# Altium schematic sheet SP26_Magnetometer2_Polarization_Circuit_Mason_Lebens.SchDoc
size A; SheetNumber: 3; SheetTotal: 6
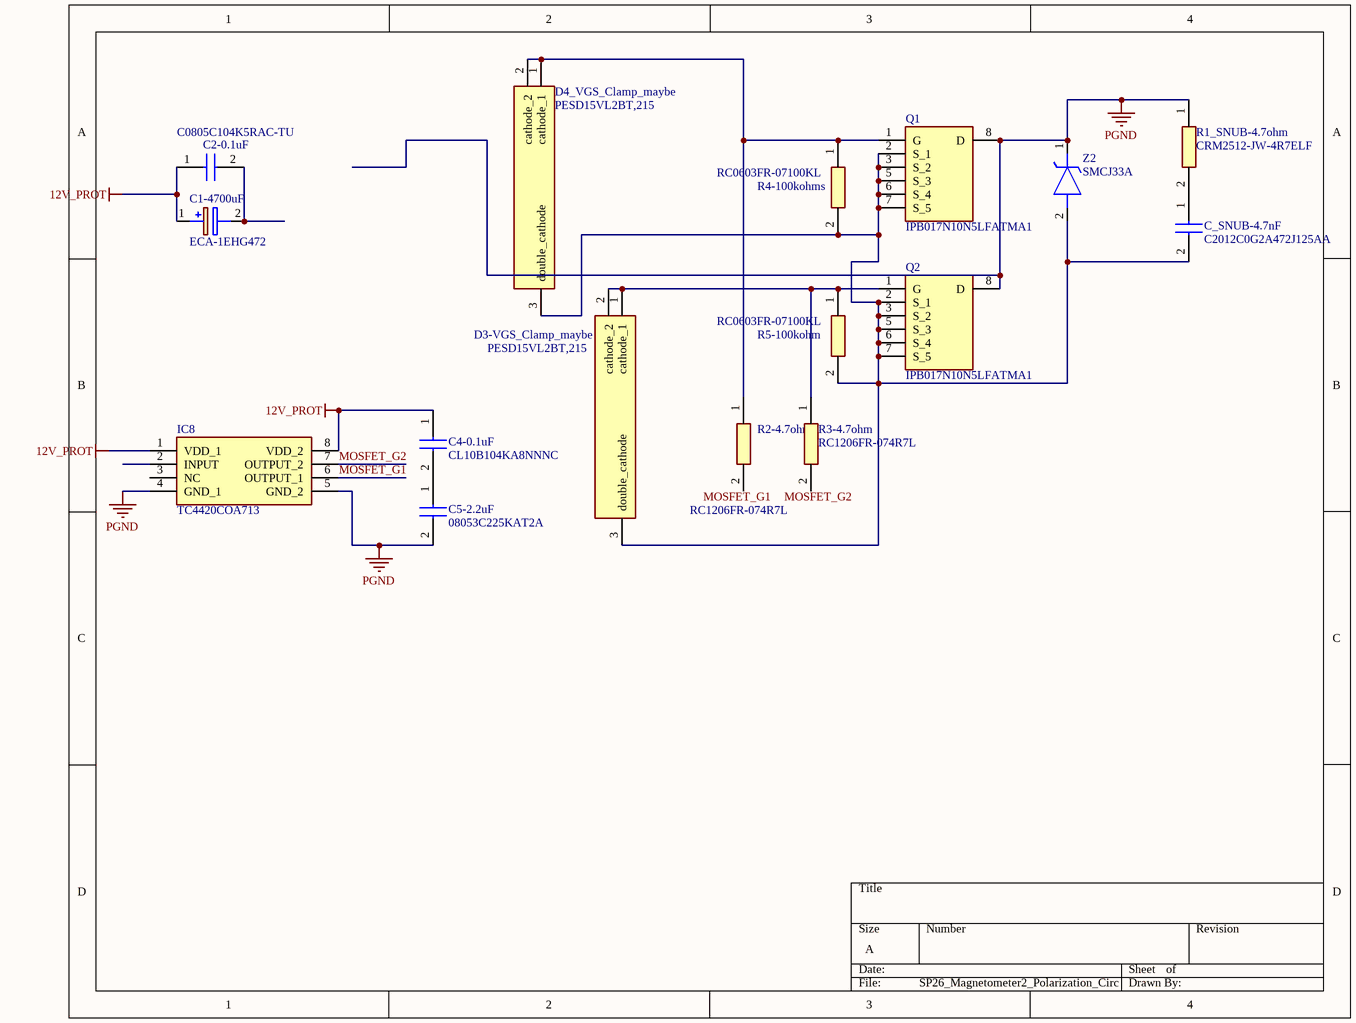
[diagram p0: SP26_Magnetometer2_Polarization_Circuit_Mason_Lebens.SchDoc]

## Parts
C1-4700uF  ECA-1EHG472  [CAPPRD750W80D800H3150]
C2-0.1uF  C0805C104K5RAC-TU  [CAPC2012X88N]
C4-0.1uF  CL10B104KA8NNNC  [CAPC1608X90N]
C5-2.2uF  08053C225KAT2A  [CAPC2012X152N]
C_SNUB-4.7nF  C2012C0G2A472J125AA  [CAPC2012X145N]
D3-VGS_Clamp_maybe  PESD15VL2BT,215  [SOT95P230X110-3N]
D4_VGS_Clamp_maybe  PESD15VL2BT,215  [SOT95P230X110-3N]
IC8  TC4420COA713  [SOIC127P600X175-8N]
Q1  IPB017N10N5LFATMA1  [PG-TO263-7-3_3]
Q2  IPB017N10N5LFATMA1  [PG-TO263-7-3_3]
R1_SNUB-4.7ohm  CRM2512-JW-4R7ELF  [RESC6331X80N]
R2-4.7ohm  RC1206FR-074R7L  [RESC3116X65N]
R3-4.7ohm  RC1206FR-074R7L  [RESC3116X65N]
R4-100kohms  RC0603FR-07100KL  [RESC1608X55N]
R5-100kohm  RC0603FR-07100KL  [RESC1608X55N]
Z2  SMCJ33A  [DIOM7969X262N]

## Nets
12V_PROT: C1-4700uF.1(+) C2-0.1uF.1 C4-0.1uF.1 IC8.1(VDD_1) IC8.8(VDD_2)
PGND: C5-2.2uF.2 IC8.4(GND_1) IC8.5(GND_2) Q1.8(D) Q2.8(D) R1_SNUB-4.7ohm.1 Z2.1(K)
MOSFET_G1: IC8.6(OUTPUT_1)
MOSFET_G2: IC8.7(OUTPUT_2)
NetC1-4700uF_2: C1-4700uF.2(-) C2-0.1uF.2
NetC4-0.1uF_2: C4-0.1uF.2 C5-2.2uF.1
NetC_SNUB-4.7nF_1: C_SNUB-4.7nF.1 R1_SNUB-4.7ohm.2
NetC_SNUB-4.7nF_2: C_SNUB-4.7nF.2 D3-VGS_Clamp_maybe.3(double_cathode) D4_VGS_Clamp_maybe.3(double_cathode) Q1.2(S_1) Q1.3(S_2) Q1.5(S_3) Q1.6(S_4) Q1.7(S_5) Q2.2(S_1) Q2.3(S_2) Q2.5(S_3) Q2.6(S_4) Q2.7(S_5) R4-100kohms.2 R5-100kohm.2 Z2.2(A)
NetD3-VGS_Clamp_maybe_1: D3-VGS_Clamp_maybe.1(cathode_1) D3-VGS_Clamp_maybe.2(cathode_2) Q2.1(G) R3-4.7ohm.1 R5-100kohm.1
NetD4_VGS_Clamp_maybe_1: D4_VGS_Clamp_maybe.1(cathode_1) D4_VGS_Clamp_maybe.2(cathode_2) Q1.1(G) R2-4.7ohm.1 R4-100kohms.1

Not connected (* = marked no-connect by the designer): IC8 2(INPUT) 3(NC); R2-4.7ohm 2; R3-4.7ohm 2

## Notes on the sheet
- Labels drawn without touching a wire or pin: MOSFET_G1, MOSFET_G2

## Library data of the parts
C1-4700uF = ECA-1EHG472: Capacitor Polarised; Manufacturer_Name: Panasonic; Datasheet Link: http://industrial.panasonic.com/cdbs/www-data/pdf/RDF0000/ABA0000C1215.pdf; Height: 31.5mm; Manufacturer_Part_Number: ECA-1EHG472; Mouser Part Number: 667-ECA-1EHG472; Mouser Price/Stock: https://www.mouser.co.uk/ProductDetail/Panasonic/ECA-1EHG472?qs=SSsrj1O973IsymGcmYwUsw%3D%3D; Arrow Part Number: ECA-1EHG472; Arrow Price/Stock: https://www.arrow.com/en/products/eca-1ehg472/panasonic?region=nac
C2-0.1uF = C0805C104K5RAC-TU: Capacitor; Manufacturer_Name: YAGEO; Datasheet Link: https://componentsearchengine.com/Datasheets/2/C0805C104K5RAC-TU.pdf; Height: 0.88mm; Manufacturer_Part_Number: C0805C104K5RAC-TU; Arrow Part Number: C0805C104K5RAC-TU; Arrow Price/Stock: https://www.arrow.com/en/products/c0805c104k5ractu/kemet-corporation
C4-0.1uF = CL10B104KA8NNNC: Capacitor; Manufacturer_Name: SAMSUNG; Datasheet Link: http://media.digikey.com/pdf/Data%20Sheets/Samsung%20PDFs/CL_Series_MLCC_ds.pdf; Height: 0.9mm; Manufacturer_Part_Number: CL10B104KA8NNNC; Mouser Part Number: 187-CL10B104KA8NNNC; Mouser Price/Stock: https://www.mouser.co.uk/ProductDetail/Samsung-Electro-Mechanics/CL10B104KA8NNNC?qs=349EhDEZ59rmu3pGeZXx0A%3D%3D; Arrow Part Number: CL10B104KA8NNNC; Arrow Price/Stock: https://www.arrow.com/en/products/cl10b104ka8nnnc/samsung-electro-mechanics?utm_currency=USD&region=europe
C5-2.2uF = 08053C225KAT2A: Capacitor; Manufacturer_Name: Kyocera AVX; Datasheet Link: https://datasheet.datasheetarchive.com/originals/distributors/Datasheets-DGA10/2418872.pdf; Height: 1.52mm; Manufacturer_Part_Number: 08053C225KAT2A; Mouser Part Number: 581-08053C225K; Mouser Price/Stock: https://www.mouser.co.uk/ProductDetail/KYOCERA-AVX/08053C225KAT2A?qs=NlNVDDZd7xSL5kNgCOchrA%3D%3D; Arrow Part Number: 08053C225KAT2A; Arrow Price/Stock: https://www.arrow.com/en/products/08053c225kat2a/avx
C_SNUB-4.7nF = C2012C0G2A472J125AA: Capacitor; Manufacturer_Name: TDK; Datasheet Link: https://product.tdk.com/info/en/catalog/datasheets/mlcc_commercial_midvoltage_en.pdf; Height: 1.45mm; Manufacturer_Part_Number: C2012C0G2A472J125AA; Mouser Part Number: 810-C2012C0G2A472J; Mouser Price/Stock: https://www.mouser.co.uk/ProductDetail/TDK/C2012C0G2A472J125AA?qs=NRhsANhppD%252Bumxfv0IUAjg%3D%3D; Arrow Part Number: C2012C0G2A472J125AA; Arrow Price/Stock: https://www.arrow.com/en/products/c2012c0g2a472j125aa/tdk?utm_currency=USD&region=nac
D3-VGS_Clamp_maybe D4_VGS_Clamp_maybe = PESD15VL2BT,215: Diode; Manufacturer_Name: Nexperia; Datasheet Link: https://assets.nexperia.com/documents/data-sheet/PESDXL2BT_SER.pdf; Height: 1.1mm; Manufacturer_Part_Number: PESD15VL2BT,215; Mouser Part Number: 771-PESD15VL2BT-T/R; Mouser Price/Stock: https://www.mouser.co.uk/ProductDetail/Nexperia/PESD15VL2BT215?qs=LOCUfHb8d9vyDy2ag0hbbA%3D%3D; Arrow Part Number: PESD15VL2BT,215; Arrow Price/Stock: https://www.arrow.com/en/products/pesd15vl2bt215/nexperia?region=nac
IC8 = TC4420COA713: Integrated Circuit; Manufacturer_Name: Microchip; Datasheet Link: https://www.mouser.de/datasheet/2/268/21419D-3441717.pdf; Height: 1.75mm; Manufacturer_Part_Number: TC4420COA713; Mouser Part Number: 579-TC4420COA713; Mouser Price/Stock: https://www.mouser.co.uk/ProductDetail/Microchip-Technology/TC4420COA713?qs=KwArPi4cUohqVwIUJ%2FLcSA%3D%3D; Arrow Part Number: TC4420COA713; Arrow Price/Stock: https://www.arrow.com/en/products/tc4420coa713/microchip-technology?utm_currency=USD&region=nac
Q1 Q2 = IPB017N10N5LFATMA1: MOSFET (N-Channel); Manufacturer_Name: Infineon; Datasheet Link: https://www.infineon.com/dgdl/Infineon-IPB017N10N5LF-DS-v02_01-EN.pdf?fileId=5546d46259d9a4bf015a5b379cf73c7f; Manufacturer_Part_Number: IPB017N10N5LFATMA1; Mouser Part Number: 726-IPB017N10N5LFATM; Mouser Price/Stock: https://www.mouser.co.uk/ProductDetail/Infineon-Technologies/IPB017N10N5LFATMA1?qs=u4fy%2FsgLU9OXGa2ke5Uurw%3D%3D; Arrow Part Number: IPB017N10N5LFATMA1; Arrow Price/Stock: https://www.arrow.com/en/products/ipb017n10n5lfatma1/infineon-technologies-ag?utm_currency=USD&region=europe
R1_SNUB-4.7ohm = CRM2512-JW-4R7ELF: Resistor; Manufacturer_Name: Bourns; Datasheet Link: http://www.bourns.com/data/global/pdfs/CRM0805_1206_2010.pdf; Height: 0.8mm; Manufacturer_Part_Number: CRM2512-JW-4R7ELF; Mouser Part Number: 652-CRM2512JW4R7ELF; Mouser Price/Stock: https://www.mouser.co.uk/ProductDetail/Bourns/CRM2512-JW-4R7ELF?qs=%2FxQVPCMPNzhuvoImpXatPQ%3D%3D; Arrow Part Number: CRM2512-JW-4R7ELF; Arrow Price/Stock: https://www.arrow.com/en/products/crm2512-jw-4r7elf/bourns
R2-4.7ohm R3-4.7ohm = RC1206FR-074R7L: Resistor; Manufacturer_Name: YAGEO; Datasheet Link: https://www.sos.sk/productdata/35/10/4/35104/RC1206.pdf; Height: 0.65mm; Manufacturer_Part_Number: RC1206FR-074R7L; Mouser Part Number: 603-RC1206FR-074R7L; Mouser Price/Stock: https://www.mouser.com/Search/Refine.aspx?Keyword=603-RC1206FR-074R7L; Arrow Part Number: RC1206FR-074R7L; Arrow Price/Stock: https://www.arrow.com/en/products/rc1206fr-074r7l/yageo
R4-100kohms R5-100kohm = RC0603FR-07100KL: Resistor; Manufacturer_Name: YAGEO; Datasheet Link: https://www.yageo.com/upload/media/product/productsearch/datasheet/rchip/PYu-RC_Group_51_RoHS_L_12.pdf; Height: 0.55mm; Manufacturer_Part_Number: RC0603FR-07100KL; Mouser Part Number: 603-RC0603FR-07100KL; Mouser Price/Stock: https://www.mouser.co.uk/ProductDetail/YAGEO/RC0603FR-07100KL?qs=e1ok2LiJcmaihem8Va5%2Fsw%3D%3D; Arrow Part Number: RC0603FR-07100KL; Arrow Price/Stock: https://www.arrow.com/en/products/rc0603fr-07100kl/yageo?utm_currency=USD&region=europe
Z2 = SMCJ33A: Zener Diode; Manufacturer_Name: LITTELFUSE; Datasheet Link: http://www.littelfuse.com/~/media/electronics/datasheets/tvs_diodes/littelfuse_tvs_diode_smcj_datasheet.pdf.pdf; Height: 2.62mm; Manufacturer_Part_Number: SMCJ33A; Mouser Part Number: 576-SMCJ33A; Mouser Price/Stock: https://www.mouser.co.uk/ProductDetail/Littelfuse/SMCJ33A?qs=JJML70Qc14uOizgItquj%2Fw%3D%3D; Arrow Part Number: SMCJ33A; Arrow Price/Stock: https://www.arrow.com/en/products/smcj33a/littelfuse?utm_currency=USD&region=europe